# Altium schematic sheet SCH-TR8253_Config.SchDoc
size A4
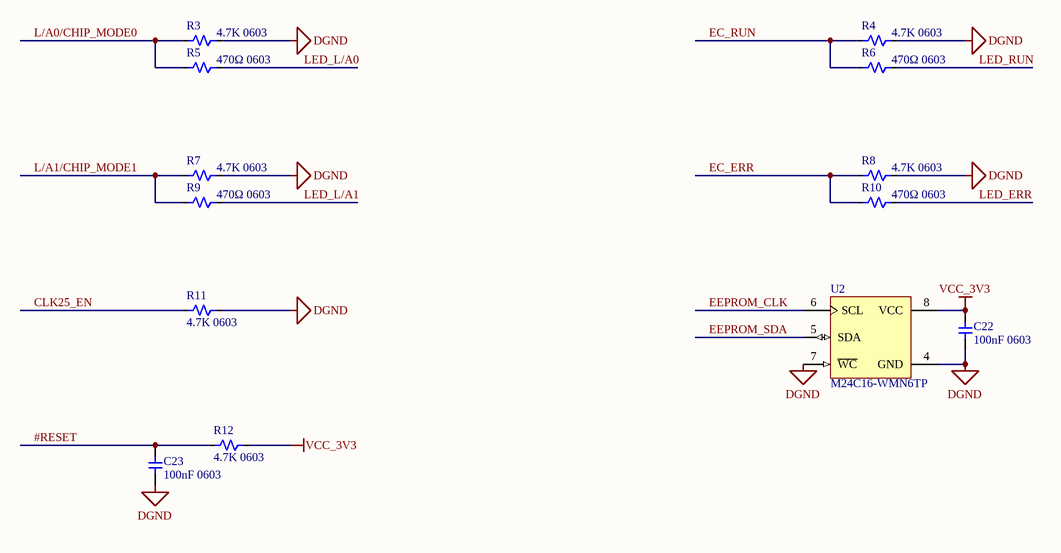
[diagram p0: SCH-TR8253_Config.SchDoc]

## Parts
C22  100nF 0603  [CAPC1608X08 (0603)]
C23  100nF 0603  [CAPC1608X08 (0603)]
R3  4.7K 0603  [RESC1608X04 (0603)]
R4  4.7K 0603  [RESC1608X04 (0603)]
R5  470Ω 0603  [RESC1608X04 (0603)]
R6  470Ω 0603  [RESC1608X04 (0603)]
R7  4.7K 0603  [RESC1608X04 (0603)]
R8  4.7K 0603  [RESC1608X04 (0603)]
R9  470Ω 0603  [RESC1608X04 (0603)]
R10  470Ω 0603  [RESC1608X04 (0603)]
R11  4.7K 0603  [RESC1608X04 (0603)]
R12  4.7K 0603  [RESC1608X04 (0603)]
U2  M24C16-WMN6TP  [SOIC127P600X175-8N]

## Nets
DGND: C22.2 C23.2 R3.1 R4.1 R7.1 R8.1 R11.1 U2.4(GND) U2.7(~{WC})
VCC_3V3: C22.1 R12.1 U2.8(VCC)
#RESET: C23.1 R12.2
CLK25_EN: R11.2
EC_ERR: R8.2 R10.2
EC_RUN: R4.2 R6.2
EEPROM_CLK: U2.6(SCL)
EEPROM_SDA: U2.5(SDA)
L/A0/CHIP_MODE0: R3.2 R5.2
L/A1/CHIP_MODE1: R7.2 R9.2
LED_ERR: R10.1
LED_L/A0: R5.1
LED_L/A1: R9.1
LED_RUN: R6.1

## Library data of the parts
C22 C23 = 100nF 0603: 贴片MLCC电容 100nF 50V X7R 10% 0603; 1st Manufacturer: Yageo; 1st PartNumber: CC0603KRX7R9BB104; 2nd Manufacturer: TDK; 2nd PartNumber: CGA3E2X7R1H104K080AA; ERP_ID: 12A20039
R3 R4 R7 R8 R11 R12 = 4.7K 0603: 贴片厚膜电阻 4.7kΩ 1% 0603; 1st Manufacturer: Yageo; 1st PartNumber: RC0603FR-074K7L; 2nd Manufacturer: Bourns; 2nd PartNumber: CR0603-FX-4701ELF; ERP_ID: 12A10041
R5 R6 R9 R10 = 470Ω 0603: 贴片厚膜电阻 470Ω 1% 0603; 1st Manufacturer: Yageo; 1st PartNumber: RC0603FR-07470RL; 2nd Manufacturer: Bourns; 2nd PartNumber: CR0603-FX-4700ELF; ERP_ID: 12A10103
U2 = M24C16-WMN6TP: I2C串行EEPROM 16K; 1st Manufacturer: ST; 2nd Manufacturer: 复旦微; 2nd PartNumber: FM24C16D-SO-T; ERP_ID: 11B20023; 1st PartNumber: M24C16-WMN6TP